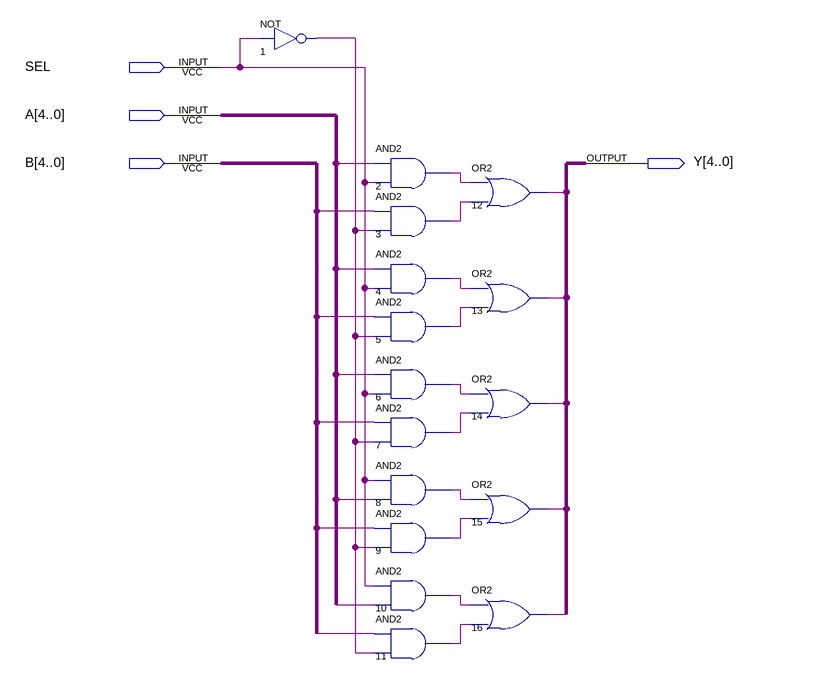
[diagram p0: schematic sheet]
// Quartus schematic multiplexador_5.bdf as structural Verilog: 16 symbols, 4 pins
module multiplexador_5 (
  input  SEL,
  input  [4:0] A,
  input  [4:0] B,
  output [4:0] Y
);

  wire n1_out, n2_out, n3_out, n4_out, n5_out, n6_out, n7_out, n8_out, n9_out, n10_out, n11_out;

  not u_1 (n1_out, SEL);
  and u_2 (n2_out, A[0], SEL);
  and u_3 (n3_out, B[0], n1_out);
  and u_4 (n4_out, A[1], SEL);
  and u_5 (n5_out, B[1], n1_out);
  and u_6 (n6_out, A[2], SEL);
  and u_7 (n7_out, B[2], n1_out);
  and u_8 (n8_out, SEL, A[3]);
  and u_9 (n9_out, B[3], n1_out);
  and u_10 (n10_out, SEL, A[4]);
  and u_11 (n11_out, B[4], n1_out);
  or u_12 (Y[0], n2_out, n3_out);
  or u_13 (Y[1], n4_out, n5_out);
  or u_14 (Y[2], n6_out, n7_out);
  or u_15 (Y[3], n8_out, n9_out);
  or u_16 (Y[4], n10_out, n11_out);
endmodule
